# Altium project Elkapod_power_supply.PrjPcb (part 3 of 6)

## Sheet Servos_DC_converter.SchDoc
size A3; SheetNumber: 4; SheetTotal: 10
Used 4 times, as channels U_Servos_DC_converter, U_Servos_DC_converter, U_Servos_DC_converter, U_Servos_DC_converter. Parts and nets are listed once, with the designators drawn on the sheet.
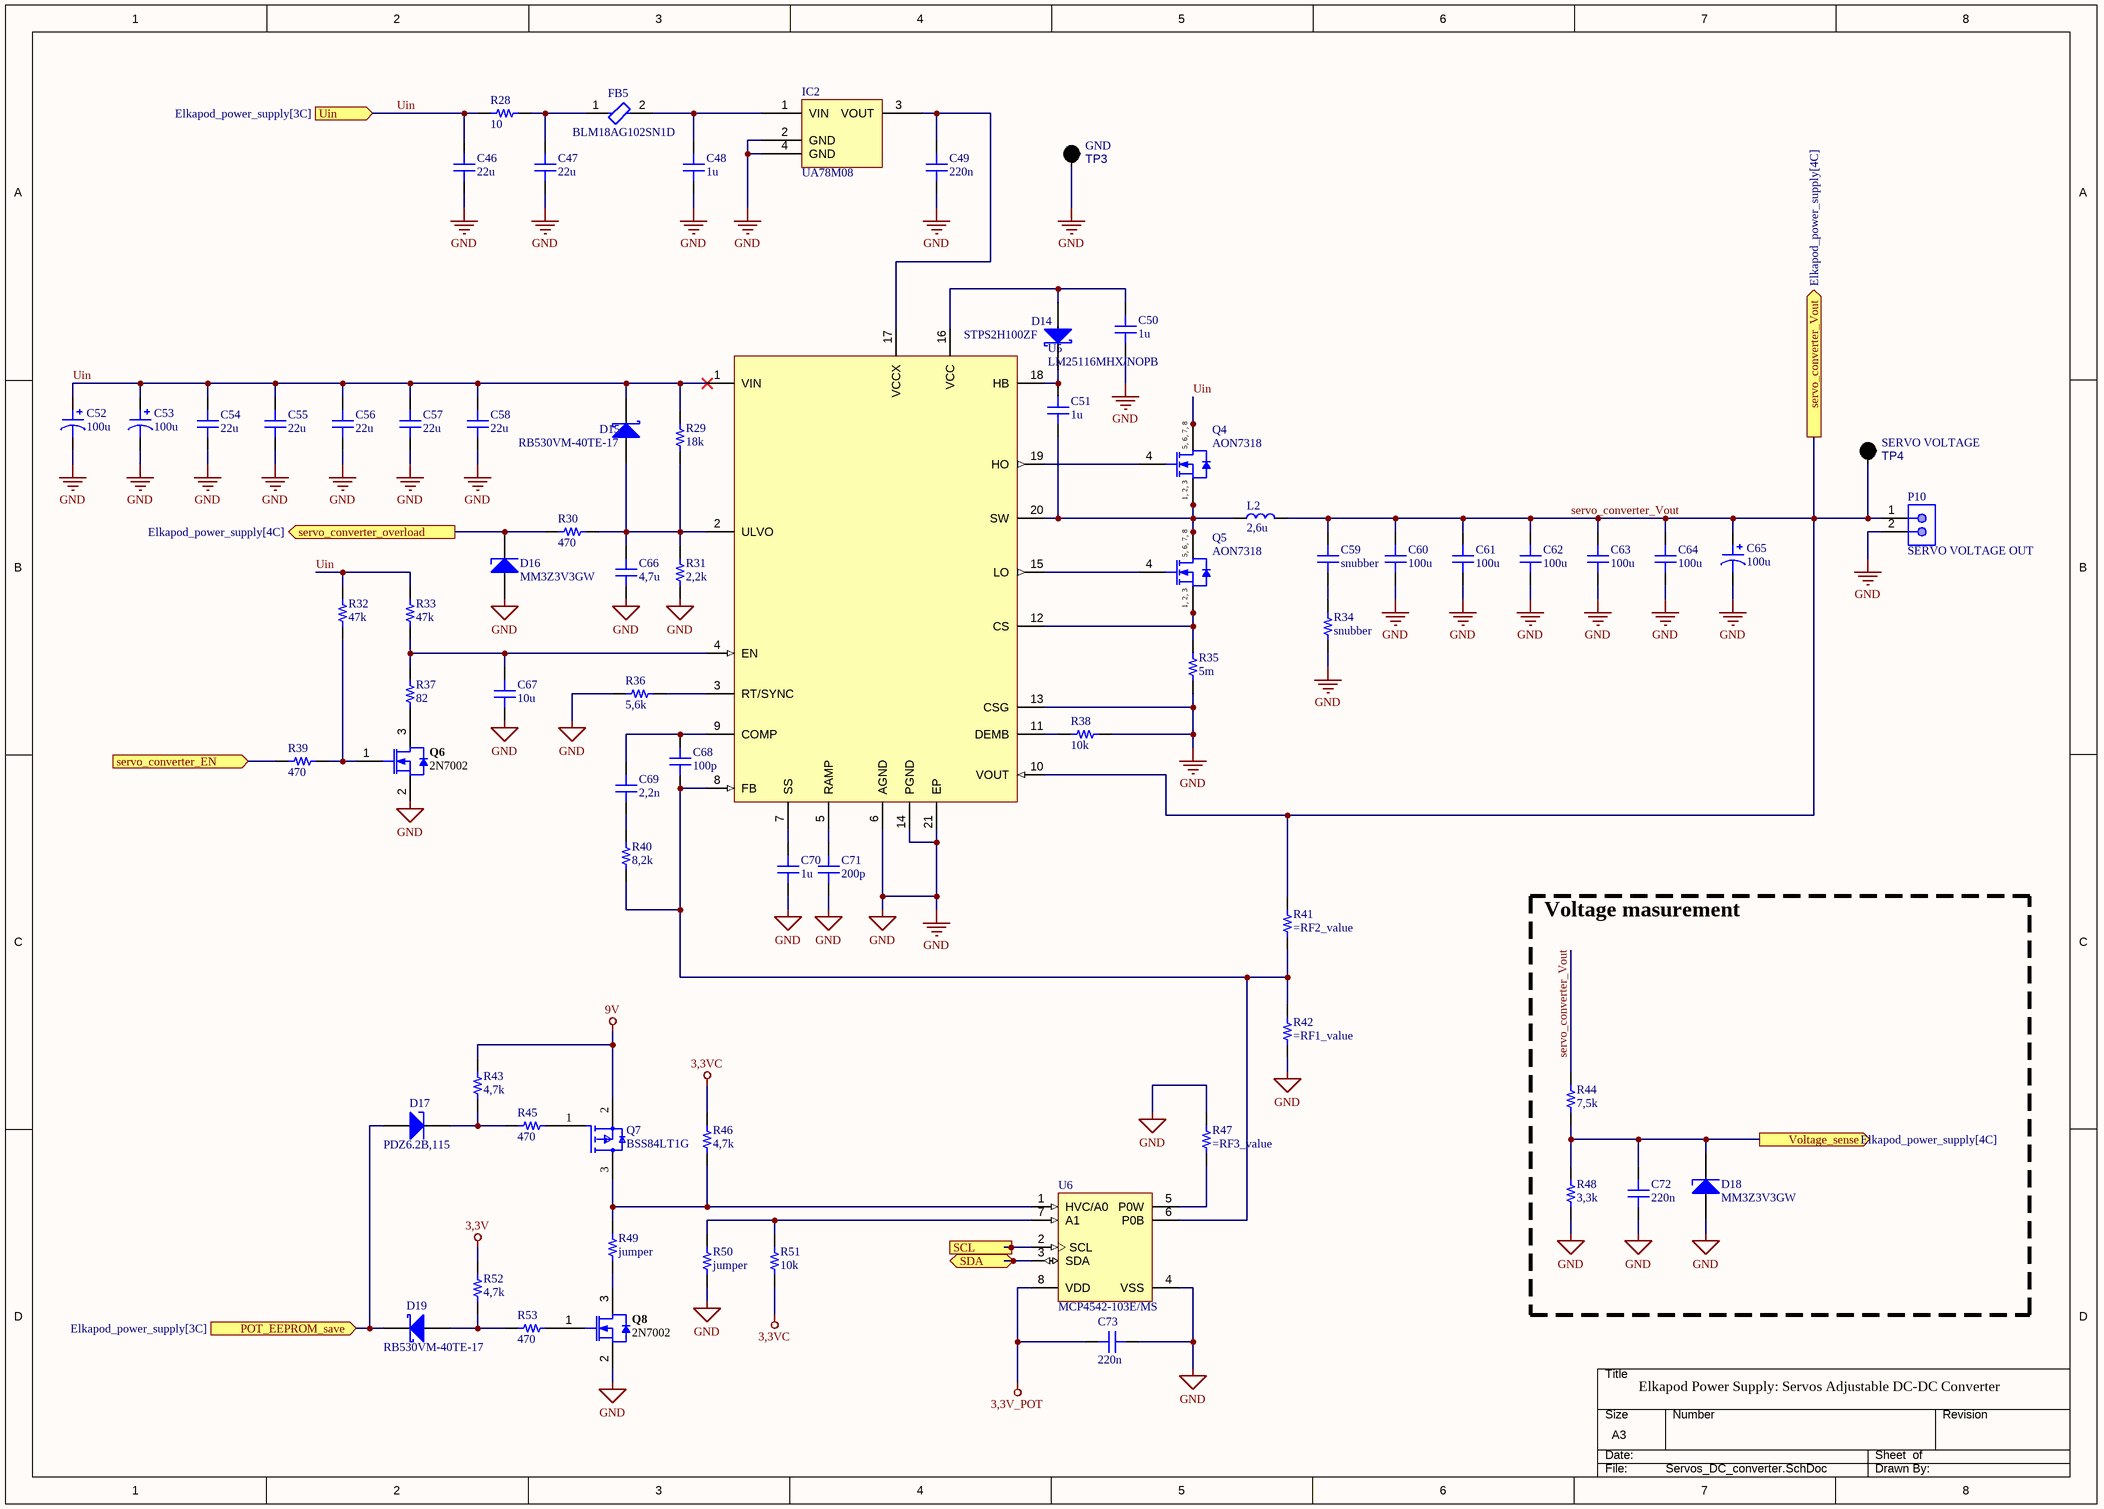
[diagram p6: Servos_DC_converter.SchDoc]

### Parts
C46  22u  [CAP 0805_2012]
C47  22u  [CAP 0805_2012]
C48  1u  [CAP 0603_1608]
C49  220n  [CAP 0603_1608]
C50  1u  [CAP 0603_1608]
C51  1u  [CAP 0603_1608]
C52  100u  [CAP ALSMD 8.3MM H10.5MM]
C53  100u  [CAP ALSMD 8.3MM H10.5MM]
C54  22u  [CAP 0805_2012]
C55  22u  [CAP 0805_2012]
C56  22u  [CAP 0805_2012]
C57  22u  [CAP 0805_2012]
C58  22u  [CAP 0805_2012]
C59  snubber  [CAP 0603_1608]
C60  100u  [CAP 1210_3225 - 1MM]
C61  100u  [CAP 1210_3225 - 1MM]
C62  100u  [CAP 1210_3225 - 1MM]
C63  100u  [CAP 1210_3225 - 1MM]
C64  100u  [CAP 1210_3225 - 1MM]
C65  100u  [CAP ALSMD 8.3MM H10.5MM]
C66  4,7u  [CAP 0603_1608]
C67  10u  [CAP 0603_1608]
C68  100p  [CAP 0603_1608]
C69  2,2n  [CAP 0603_1608]
C70  1u  [CAP 0603_1608]
C71  200p  [CAP 0603_1608]
C72  220n  [CAP 0603_1608]
C73  220n  [CAP 0603_1608]
D14  STPS2H100ZF  [DIOD-SOD-123-2_V]
D15  RB530VM-40TE-17  [SOD-323]
D16  MM3Z3V3GW  [SOD323]
D17  PDZ6.2B,115  [SOD323]
D18  MM3Z3V3GW  [SOD323]
D19  RB530VM-40TE-17  [SOD-323]
FB5  BLM18AG102SN1D  [FP-BLM18-0_15-t0_8-MFG]
IC2  UA78M08  [TI SOT-223 DCY]
L2  2,6u  [18,3x18,2_INDUCTOR]
P10  SERVO VOLTAGE OUT  [MOLX-22-23-2021_V]
Q4  AON7318  [INF-PG-TSDSON-8-1_V]
Q5  AON7318  [INF-PG-TSDSON-8-1_V]
Q6  2N7002  [INF-PG-SOT23_M]
Q7  BSS84LT1G  [FP-318-08-IPC_A]
Q8  2N7002  [INF-PG-SOT23_M]
R28  10  [RES 1206_3216]
R29  18k  [RES 0603_1608]
R30  470  [RES 0603_1608]
R31  2,2k  [RES 0603_1608]
R32  47k  [RES 0603_1608]
R33  47k  [RES 0603_1608]
R34  snubber  [RES 1206_3216]
R35  5m  [STACKPOLE CSM2512]
R36  5,6k  [RES 0603_1608]
R37  82  [RES 0603_1608]
R38  10k  [RES 0603_1608]
R39  470  [RES 0603_1608]
R40  8,2k  [RES 0603_1608]
R41  (no value)  [RES 0603_1608]
R42  (no value)  [RES 0603_1608]
R43  4,7k  [RES 0603_1608]
R44  7,5k  [RES 0603_1608]
R45  470  [RES 0603_1608]
R46  4,7k  [RES 0603_1608]
R47  (no value)  [RES 0603_1608]
R48  3,3k  [RES 0603_1608]
R49  jumper  [RES 0603_1608]
R50  jumper  [RES 0603_1608]
R51  10k  [RES 0603_1608]
R52  4,7k  [RES 0603_1608]
R53  470  [RES 0603_1608]
TP3  GND  [Keystone_5006_BLACK]
TP4  SERVO VOLTAGE  [Keystone_5006_BLACK]
U5  LM25116MHX/NOPB  [PWP0020A_L]
U6  MCP4542-103E/MS  [MSOP-MS8_N]

### Blocks framed on the sheet
Voltage masurement: C72 D18 R44 R48

### Ports
POT_EEPROM_save (in, see Elkapod_power_supply[3C]), SCL (in, see Elkapod_power_supply[3C], Controllable_voltage_outputs[2A], Electronics_power_supply_DC_converter[7C], Logic_controller[1D], Servos_controller[1C]), SDA (bidir, see Elkapod_power_supply[3C], Controllable_voltage_outputs[2B], Electronics_power_supply_DC_converter[7C], Logic_controller[1D], Servos_controller[1C]), servo_converter_EN (in, see Elkapod_power_supply[4C]), servo_converter_overload (out, see Elkapod_power_supply[4C]), servo_converter_Vout (out, see Elkapod_power_supply[4C]), Uin (in, see Elkapod_power_supply[3C]), Voltage_sense (out, see Elkapod_power_supply[4C])

### Nets
3,3V: R52.1
3,3V_POT: C73.2 U6.8(VDD)
3,3VC: R46.1 R51.2
9V: Q7.2(S) R43.1
GND: C46.1 C47.1 C48.1 C49.1 C50.2 C52.2 C53.2 C54.1 C55.1 C56.1 C57.1 C58.1 C60.1 C61.1 C62.1 C63.1 C64.1 C65.2 C66.1 C67.1 C70.1 C71.1 C72.1 C73.1 D16.1(A) D18.1(A) IC2.2(GND) IC2.4(GND) P10.2 Q6.2(SOURCE) Q8.2(SOURCE) R31.1 R34.1 R35.1 R36.2 R38.1 R42.2 R47.1 R48.2 R50.2 TP3.0 U5.6(AGND) U5.13(CSG) U5.14(PGND) U5.21(EP) U6.4(VSS)
POT_EEPROM_save: D17.1(A) D19.1(K) ; port POT_EEPROM_save
SCL: U6.2(SCL) ; port SCL
SDA: U6.3(SDA) ; port SDA
servo_converter_EN: R39.1 ; port servo_converter_EN
servo_converter_overload: D16.2(K) R30.2 ; port servo_converter_overload
servo_converter_Vout: C59.2 C60.2 C61.2 C62.2 C63.2 C64.2 C65.1 L2.2 P10.1 R41.1 R44.1 TP4.0 U5.10(VOUT) ; port servo_converter_Vout
Uin: C46.2 C52.1 C53.1 C54.2 C55.2 C56.2 C57.2 C58.2 D15.1(K) Q4.5(DRAIN) Q4.6(DRAIN) Q4.7(DRAIN) Q4.8(DRAIN) R28.1 R29.1 R32.1 R33.1 U5.1(VIN) ; port Uin
Voltage_sense: C72.2 D18.2(K) R44.2 R48.1 ; port Voltage_sense
NetC47_2: C47.2 FB5.1 R28.2
NetC48_2: C48.2 FB5.2 IC2.1(VIN)
NetC49_2: C49.2 IC2.3(VOUT) U5.17(VCCX)
NetC50_1: C50.1 D14.1(A) U5.16(VCC)
NetC51_1: C51.1 L2.1 Q4.1(SOURCE) Q4.2(SOURCE) Q4.3(SOURCE) Q5.5(DRAIN) Q5.6(DRAIN) Q5.7(DRAIN) Q5.8(DRAIN) U5.20(SW)
NetC51_2: C51.2 D14.2(K) U5.18(HB)
NetC59_1: C59.1 R34.2
NetC66_2: C66.2 D15.2(A) R29.2 R30.1 R31.2 U5.2(ULVO)
NetC67_2: C67.2 R33.2 R37.1 U5.4(EN)
NetC68_1: C68.1 C69.1 U5.9(COMP)
NetC68_2: C68.2 R40.2 R41.2 R42.1 U5.8(FB) U6.6(P0B)
NetC69_2: C69.2 R40.1
NetC70_2: C70.2 U5.7(SS)
NetC71_2: C71.2 U5.5(RAMP)
NetD17_2: D17.2(K) R43.2 R45.2
NetD19_2: D19.2(A) R52.2 R53.2
NetQ4_4: Q4.4(GATE) U5.19(HO)
NetQ5_1: Q5.1(SOURCE) Q5.2(SOURCE) Q5.3(SOURCE) R35.2 U5.12(CS)
NetQ5_4: Q5.4(GATE) U5.15(LO)
NetQ6_1: Q6.1(GATE) R32.2 R39.2
NetQ6_3: Q6.3(DRAIN) R37.2
NetQ7_1: Q7.1(G) R45.1
NetQ7_3: Q7.3(D) R46.2 R49.1 U6.1(HVC/A0)
NetQ8_1: Q8.1(GATE) R53.1
NetQ8_3: Q8.3(DRAIN) R49.2
NetR36_1: R36.1 U5.3(RT/SYNC)
NetR38_2: R38.2 U5.11(DEMB)
NetR47_2: R47.2 U6.5(P0W)
NetR50_1: R50.1 R51.1 U6.7(A1)

### Channels
U_Servos_DC_converter: designators C46=C46_1 C47=C47_1 C48=C48_1 C49=C49_1 C50=C50_1 C51=C51_1 C52=C52_1 C53=C53_1 C54=C54_1 C55=C55_1 C56=C56_1 C57=C57_1 C58=C58_1 C59=C59_1 C60=C60_1 C61=C61_1 C62=C62_1 C63=C63_1 C64=C64_1 C65=C65_1 C66=C66_1 C67=C67_1 C68=C68_1 C69=C69_1 C70=C70_1 C71=C71_1 C72=C72_1#2 C73=C73_1#2 D14=D14_1 D15=D15_1 D16=D16_1 D17=D17_1 D18=D18_1 D19=D19_1 FB5=FB5_1 IC2=IC2_1 L2=L2_1 P10=P10_1 Q4=Q4_1 Q5=Q5_1 Q6=Q6_1 Q7=Q7_1#2 Q8=Q8_1#2 R28=R28_1 R29=R29_1 R30=R30_1 R31=R31_1 R32=R32_1 R33=R33_1 R34=R34_1 R35=R35_1 R36=R36_1 R37=R37_1 R38=R38_1 R39=R39_1 R40=R40_1 R41=R41_1 R42=R42_1 R43=R43_1 R44=R44_1 R45=R45_1 R46=R46_1#2 R47=R47_1#2 R48=R48_1#2 R49=R49_1#2 R50=R50_1#2 R51=R51_1 R52=R52_1 R53=R53_1 TP3=TP3_1 TP4=TP4_1 U5=U5_1 U6=U6_1; ports POT_EEPROM_save=POT_HVC SCL=SCL SDA=SDA servo_converter_EN=NetR39_1_1 servo_converter_overload=CONV1_OC servo_converter_Vout=servo_converter_Vout Uin=Uin Voltage_sense=NetC72_1#2_2
U_Servos_DC_converter: designators C46=C46_2 C47=C47_2 C48=C48_2 C49=C49_2 C50=C50_2 C51=C51_2 C52=C52_2 C53=C53_2 C54=C54_2 C55=C55_2 C56=C56_2 C57=C57_2 C58=C58_2 C59=C59_2 C60=C60_2 C61=C61_2 C62=C62_2 C63=C63_2 C64=C64_2 C65=C65_2 C66=C66_2 C67=C67_2 C68=C68_2 C69=C69_2 C70=C70_2 C71=C71_2 C72=C72_2#2 C73=C73_2#2 D14=D14_2 D15=D15_2 D16=D16_2 D17=D17_2 D18=D18_2 D19=D19_2 FB5=FB5_2 IC2=IC2_2 L2=L2_2 P10=P10_2 Q4=Q4_2 Q5=Q5_2 Q6=Q6_2 Q7=Q7_2#2 Q8=Q8_2#2 R28=R28_2 R29=R29_2 R30=R30_2 R31=R31_2 R32=R32_2 R33=R33_2 R34=R34_2 R35=R35_2 R36=R36_2 R37=R37_2 R38=R38_2 R39=R39_2 R40=R40_2 R41=R41_2 R42=R42_2 R43=R43_2 R44=R44_2 R45=R45_2 R46=R46_2#2 R47=R47_2#2 R48=R48_2#2 R49=R49_2#2 R50=R50_2#2 R51=R51_2 R52=R52_2 R53=R53_2 TP3=TP3_2 TP4=TP4_2 U5=U5_2 U6=U6_2; ports POT_EEPROM_save=POT_HVC SCL=SCL SDA=SDA servo_converter_EN=NetR39_2_1 servo_converter_overload=CONV2_OC servo_converter_Vout=servo_converter_Vout Uin=Uin Voltage_sense=NetC72_2#2_2
U_Servos_DC_converter: designators C46=C46_3 C47=C47_3 C48=C48_3 C49=C49_3 C50=C50_3 C51=C51_3 C52=C52_3 C53=C53_3 C54=C54_3 C55=C55_3 C56=C56_3 C57=C57_3 C58=C58_3 C59=C59_3 C60=C60_3 C61=C61_3 C62=C62_3 C63=C63_3 C64=C64_3 C65=C65_3 C66=C66_3 C67=C67_3 C68=C68_3 C69=C69_3 C70=C70_3 C71=C71_3 C72=C72_3#2 C73=C73_3#2 D14=D14_3 D15=D15_3 D16=D16_3 D17=D17_3 D18=D18_3 D19=D19_3 FB5=FB5_3 IC2=IC2_3 L2=L2_3 P10=P10_3 Q4=Q4_3 Q5=Q5_3 Q6=Q6_3 Q7=Q7_3#2 Q8=Q8_3#2 R28=R28_3 R29=R29_3 R30=R30_3 R31=R31_3 R32=R32_3 R33=R33_3 R34=R34_3 R35=R35_3 R36=R36_3 R37=R37_3 R38=R38_3 R39=R39_3 R40=R40_3 R41=R41_3 R42=R42_3 R43=R43_3 R44=R44_3 R45=R45_3 R46=R46_3#2 R47=R47_3#2 R48=R48_3#2 R49=R49_3#2 R50=R50_3#2 R51=R51_3 R52=R52_3 R53=R53_3 TP3=TP3_3 TP4=TP4_3 U5=U5_3 U6=U6_3; ports POT_EEPROM_save=POT_HVC SCL=SCL SDA=SDA servo_converter_EN=NetR39_3_1 servo_converter_overload=CONV3_OC servo_converter_Vout=servo_converter_Vout Uin=Uin Voltage_sense=NetC72_3#2_2
U_Servos_DC_converter: designators C46=C46_4 C47=C47_4 C48=C48_4 C49=C49_4 C50=C50_4 C51=C51_4 C52=C52_4 C53=C53_4 C54=C54_4 C55=C55_4 C56=C56_4 C57=C57_4 C58=C58_4 C59=C59_4 C60=C60_4 C61=C61_4 C62=C62_4 C63=C63_4 C64=C64_4 C65=C65_4 C66=C66_4 C67=C67_4 C68=C68_4 C69=C69_4 C70=C70_4 C71=C71_4 C72=C72_4#2 C73=C73_4#2 D14=D14_4 D15=D15_4 D16=D16_4 D17=D17_4 D18=D18_4 D19=D19_4 FB5=FB5_4 IC2=IC2_4 L2=L2_4 P10=P10_4 Q4=Q4_4 Q5=Q5_4 Q6=Q6_4 Q7=Q7_4#2 Q8=Q8_4#2 R28=R28_4 R29=R29_4 R30=R30_4 R31=R31_4 R32=R32_4 R33=R33_4 R34=R34_4 R35=R35_4 R36=R36_4 R37=R37_4 R38=R38_4 R39=R39_4 R40=R40_4 R41=R41_4 R42=R42_4 R43=R43_4 R44=R44_4 R45=R45_4 R46=R46_4#2 R47=R47_4#2 R48=R48_4#2 R49=R49_4#2 R50=R50_4#2 R51=R51_4 R52=R52_4 R53=R53_4 TP3=TP3_4 TP4=TP4_4 U5=U5_4 U6=U6_4; ports POT_EEPROM_save=POT_HVC SCL=SCL SDA=SDA servo_converter_EN=MANIP_CONV_EN servo_converter_overload=CONV4_OC servo_converter_Vout=servo_converter_Vout Uin=Uin Voltage_sense=U_CONV4_SENSE

### Notes on the sheet
- Elkapod Power Supply: Servos Adjustable DC-DC Converter
- DWG. NO.
- REV.
- SHT.
- THIS DOCUMENT AND THE DATA DISCLOSED HEREIN OR HEREWITH IS THE PROPERTY OF ALTIUM LIMITED AND MAY BE FREELY DISTRIBUTED IN WHOLE. NO RIGHTS ARE RESERVED OR EXPRESS OR IMPLIED WARANTEE GIVEN.
- REVISION
- DESCRIPTION
- DATE
- APPROVED
- ENG:
- APPROVALS
- PROJECT
- DSN:
- CHK:
- REFERENCE DOCUMENTS
- PROJECT REVISION:
- TITLE
- DOCUMENT REVISION:
- DESIGN ITEM:
- BOM:
- FAB DWG:
- PCB DWG:
- ASSY DWG:
- SCALE:
- SIZE
- B
- CAGE CODE
- FILE NAME
- DWG NO.
- SHEET
- OF
- REV
- (in symbol BSZ050N03MS G) 5, 6, 7, 8; 1, 2, 3
- (in symbol AON7318) 5, 6, 7, 8; 1, 2, 3

### Library data of the parts
C46 C47 C54-C58 = VJ0805Y684KXQTW1BC: CAP CER 22UF 25V X7R 0805; manufacturer: Vishay Vitramon; Tolerance: ±10%; Voltage - Rated: 10V; Part Number: VJ0805Y684KXQTW1BC; Value: 22u; Applications: General Purpose; Capacitance: 22u; componentlink1description: Datasheet; componentlink1url: https://www.vishay.com/docs/28548/vjw1bcbascomseries.pdf; componentlink2description: DigiKey Link; componentlink2url: https://www.digikey.com/en/products/detail/vishay-vitramon/VJ0805Y684KXQTW1BC/8313569; Device Package: 0805 (2012 Metric); lastupdated: 09.02.2024 20:13:13; Lifecycle Status: Active; Minimum Order: 1; Mounting Type: Surface Mount, MLCC; Operating Temperature: -55°C ~ 125°C; Package / Case: 0805 (2012 Metric); packaging: TapeAndReel; partid: 57262; price: 0.05; series: VJ W1BC; Size / Dimension: 0.079" L x 0.049" W (2.00mm x 1.25mm); Temperature Coefficient: X7R; Thickness (Max): 0.053" (1.35mm)
C48 C50 C51 = C0603C272F3GAC7867: CAP CER 1uF 25V X5R 0603; manufacturer: KEMET; Temperature Coefficient: C0G, NP0; Tolerance: ±1%; Part Number: C0603C272F3GAC7867; Value: 1u; Applications: General Purpose; Capacitance: 1u; componentlink1description: Datasheet; componentlink1url: https://api.kemet.com/component-edge/download/datasheet/C0603C272F3GACTU.pdf; componentlink2description: DigiKey Link; componentlink2url: https://www.digikey.com/en/products/detail/kemet/C0603C272F3GAC7867/2200413; Device Package: 0603 (1608 Metric); Features: Low ESL; lastupdated: 09.02.2024 20:10:30; Lifecycle Status: Active; Minimum Order: 1; Mounting Type: Surface Mount, MLCC; Operating Temperature: -55°C ~ 125°C; Package / Case: 0603 (1608 Metric); packaging: TapeAndReel; partid: 2138; Part Status: Active; price: 0.40; series: SMD Comm C0G; Size / Dimension: 0.063" L x 0.031" W (1.60mm x 0.80mm); Thickness (Max): 0.034" (0.87mm); Voltage - Rated: 25V
C49 C72 C73 = C0603C272F3GAC7867: CAP CER 220nF 25V X5R 0603; manufacturer: KEMET; Temperature Coefficient: C0G, NP0; Tolerance: ±1%; Part Number: C0603C272F3GAC7867; Value: 220n; Applications: General Purpose; Capacitance: 220n; componentlink1description: Datasheet; componentlink1url: https://api.kemet.com/component-edge/download/datasheet/C0603C272F3GACTU.pdf; componentlink2description: DigiKey Link; componentlink2url: https://www.digikey.com/en/products/detail/kemet/C0603C272F3GAC7867/2200413; Device Package: 0603 (1608 Metric); Features: Low ESL; lastupdated: 09.02.2024 20:10:30; Lifecycle Status: Active; Minimum Order: 1; Mounting Type: Surface Mount, MLCC; Operating Temperature: -55°C ~ 125°C; Package / Case: 0603 (1608 Metric); packaging: TapeAndReel; partid: 2138; Part Status: Active; price: 0.40; series: SMD Comm C0G; Size / Dimension: 0.063" L x 0.031" W (1.60mm x 0.80mm); Thickness (Max): 0.034" (0.87mm); Voltage - Rated: 25V
C52 C53 C65 = EEE-TC1C101P: UCD1V101MNL1GS; CAP ALUM 100UF 20% 16V SMD; value: 100u
C59 = C0603C272F3GAC7867: CAP CER 50V X5R 0603; manufacturer: KEMET; Temperature Coefficient: C0G, NP0; Tolerance: ±1%; Voltage - Rated: 25V; Part Number: C0603C272F3GAC7867; Value: snubber; Applications: General Purpose; Capacitance: snubber; componentlink1description: Datasheet; componentlink1url: https://api.kemet.com/component-edge/download/datasheet/C0603C272F3GACTU.pdf; componentlink2description: DigiKey Link; componentlink2url: https://www.digikey.com/en/products/detail/kemet/C0603C272F3GAC7867/2200413; Device Package: 0603 (1608 Metric); Features: Low ESL; lastupdated: 09.02.2024 20:10:30; Lifecycle Status: Active; Minimum Order: 1; Mounting Type: Surface Mount, MLCC; Operating Temperature: -55°C ~ 125°C; Package / Case: 0603 (1608 Metric); packaging: TapeAndReel; partid: 2138; Part Status: Active; price: 0.40; series: SMD Comm C0G; Size / Dimension: 0.063" L x 0.031" W (1.60mm x 0.80mm); Thickness (Max): 0.034" (0.87mm)
C60-C64 = CAN13X104KARAC7800: CAP CER 1210 100UF 10V X7R; manufacturer: KEMET; Tolerance: ±10%; Voltage - Rated: 250VAC; Part Number: CAN13X104KARAC7800; Value: 100u; Applications: Boardflex Sensitive; Capacitance: 100u; componentlink1description: Datasheet; componentlink1url: //media.digikey.com/pdf/Data%20Sheets/Kemet%20PDFs/CAN13X104KARACTU_Spec.pdf; componentlink2description: DigiKey Link; componentlink2url: https://www.digikey.com/en/products/detail/kemet/CAN13X104KARAC7800/9962480; Device Package: 1210 (3225 Metric); Features: Low ESL, Soft Termination; lastupdated: 04.06.2024 19:21:07; Lifecycle Status: Active; Minimum Order: 1; Mounting Type: Surface Mount, MLCC; Operating Temperature: -55°C ~ 125°C; Package / Case: 1210 (3225 Metric); packaging: TapeAndReel; partid: 23615; Part Status: Active; price: 0.39; series: CAN SMD Indust X7R; Size / Dimension: 0.130" L x 0.102" W (3.30mm x 2.60mm); Temperature Coefficient: X7R; Thickness (Max): 0.110" (2.80mm)
C66 = C0603C272F3GAC7867: CAP CER 4,7uF 25V X5R 0603; manufacturer: KEMET; Temperature Coefficient: C0G, NP0; Tolerance: ±1%; Part Number: C0603C272F3GAC7867; Value: 4,7u; Applications: General Purpose; Capacitance: 4,7u; componentlink1description: Datasheet; componentlink1url: https://api.kemet.com/component-edge/download/datasheet/C0603C272F3GACTU.pdf; componentlink2description: DigiKey Link; componentlink2url: https://www.digikey.com/en/products/detail/kemet/C0603C272F3GAC7867/2200413; Device Package: 0603 (1608 Metric); Features: Low ESL; lastupdated: 09.02.2024 20:10:30; Lifecycle Status: Active; Minimum Order: 1; Mounting Type: Surface Mount, MLCC; Operating Temperature: -55°C ~ 125°C; Package / Case: 0603 (1608 Metric); packaging: TapeAndReel; partid: 2138; Part Status: Active; price: 0.40; series: SMD Comm C0G; Size / Dimension: 0.063" L x 0.031" W (1.60mm x 0.80mm); Thickness (Max): 0.034" (0.87mm); Voltage - Rated: 25V
C67 = C0603C272F3GAC7867: CAP CER 10uF 35V X5R 0603; manufacturer: KEMET; Temperature Coefficient: C0G, NP0; Tolerance: ±1%; Voltage - Rated: 25V; Part Number: C0603C272F3GAC7867; Value: 10u; Applications: General Purpose; Capacitance: 10u; componentlink1description: Datasheet; componentlink1url: https://api.kemet.com/component-edge/download/datasheet/C0603C272F3GACTU.pdf; componentlink2description: DigiKey Link; componentlink2url: https://www.digikey.com/en/products/detail/kemet/C0603C272F3GAC7867/2200413; Device Package: 0603 (1608 Metric); Features: Low ESL; lastupdated: 09.02.2024 20:10:30; Lifecycle Status: Active; Minimum Order: 1; Mounting Type: Surface Mount, MLCC; Operating Temperature: -55°C ~ 125°C; Package / Case: 0603 (1608 Metric); packaging: TapeAndReel; partid: 2138; Part Status: Active; price: 0.40; series: SMD Comm C0G; Size / Dimension: 0.063" L x 0.031" W (1.60mm x 0.80mm); Thickness (Max): 0.034" (0.87mm)
C68 = C0603C272F3GAC7867: CAP CER 100pF 50V G0C 0603; manufacturer: KEMET; Temperature Coefficient: C0G, NP0; Tolerance: ±1%; Voltage - Rated: 25V; Part Number: C0603C272F3GAC7867; Value: 100p; Applications: General Purpose; Capacitance: 100p; componentlink1description: Datasheet; componentlink1url: https://api.kemet.com/component-edge/download/datasheet/C0603C272F3GACTU.pdf; componentlink2description: DigiKey Link; componentlink2url: https://www.digikey.com/en/products/detail/kemet/C0603C272F3GAC7867/2200413; Device Package: 0603 (1608 Metric); Features: Low ESL; lastupdated: 09.02.2024 20:10:30; Lifecycle Status: Active; Minimum Order: 1; Mounting Type: Surface Mount, MLCC; Operating Temperature: -55°C ~ 125°C; Package / Case: 0603 (1608 Metric); packaging: TapeAndReel; partid: 2138; Part Status: Active; price: 0.40; series: SMD Comm C0G; Size / Dimension: 0.063" L x 0.031" W (1.60mm x 0.80mm); Thickness (Max): 0.034" (0.87mm)
C69 = C0603C272F3GAC7867: CAP CER 2,2nF 50V G0C 0603; manufacturer: KEMET; Temperature Coefficient: C0G, NP0; Tolerance: ±1%; Voltage - Rated: 25V; Part Number: C0603C272F3GAC7867; Value: 2,2n; Applications: General Purpose; Capacitance: 2,2n; componentlink1description: Datasheet; componentlink1url: https://api.kemet.com/component-edge/download/datasheet/C0603C272F3GACTU.pdf; componentlink2description: DigiKey Link; componentlink2url: https://www.digikey.com/en/products/detail/kemet/C0603C272F3GAC7867/2200413; Device Package: 0603 (1608 Metric); Features: Low ESL; lastupdated: 09.02.2024 20:10:30; Lifecycle Status: Active; Minimum Order: 1; Mounting Type: Surface Mount, MLCC; Operating Temperature: -55°C ~ 125°C; Package / Case: 0603 (1608 Metric); packaging: TapeAndReel; partid: 2138; Part Status: Active; price: 0.40; series: SMD Comm C0G; Size / Dimension: 0.063" L x 0.031" W (1.60mm x 0.80mm); Thickness (Max): 0.034" (0.87mm)
C70 = C0603C272F3GAC7867: CAP CER 1uF 16V X5R 0603; manufacturer: KEMET; Temperature Coefficient: C0G, NP0; Tolerance: ±1%; Voltage - Rated: 25V; Part Number: C0603C272F3GAC7867; Value: 1u; Applications: General Purpose; Capacitance: 1u; componentlink1description: Datasheet; componentlink1url: https://api.kemet.com/component-edge/download/datasheet/C0603C272F3GACTU.pdf; componentlink2description: DigiKey Link; componentlink2url: https://www.digikey.com/en/products/detail/kemet/C0603C272F3GAC7867/2200413; Device Package: 0603 (1608 Metric); Features: Low ESL; lastupdated: 09.02.2024 20:10:30; Lifecycle Status: Active; Minimum Order: 1; Mounting Type: Surface Mount, MLCC; Operating Temperature: -55°C ~ 125°C; Package / Case: 0603 (1608 Metric); packaging: TapeAndReel; partid: 2138; Part Status: Active; price: 0.40; series: SMD Comm C0G; Size / Dimension: 0.063" L x 0.031" W (1.60mm x 0.80mm); Thickness (Max): 0.034" (0.87mm)
C71 = C0603C272F3GAC7867: CAP CER 200pF 50V G0C 0603; manufacturer: KEMET; Temperature Coefficient: C0G, NP0; Tolerance: ±1%; Voltage - Rated: 25V; Part Number: C0603C272F3GAC7867; Value: 200p; Applications: General Purpose; Capacitance: 200p; componentlink1description: Datasheet; componentlink1url: https://api.kemet.com/component-edge/download/datasheet/C0603C272F3GACTU.pdf; componentlink2description: DigiKey Link; componentlink2url: https://www.digikey.com/en/products/detail/kemet/C0603C272F3GAC7867/2200413; Device Package: 0603 (1608 Metric); Features: Low ESL; lastupdated: 09.02.2024 20:10:30; Lifecycle Status: Active; Minimum Order: 1; Mounting Type: Surface Mount, MLCC; Operating Temperature: -55°C ~ 125°C; Package / Case: 0603 (1608 Metric); packaging: TapeAndReel; partid: 2138; Part Status: Active; price: 0.40; series: SMD Comm C0G; Size / Dimension: 0.063" L x 0.031" W (1.60mm x 0.80mm); Thickness (Max): 0.034" (0.87mm)
D14 = CMP-0303-00004-1: Schottky diode; 2A; 100V
D15 D19 = BAS140W: Schottky diode; 0,1A; 40V; Published: 21-Mar-2003; LatestRevisionDate: 19-Mar-2004; LatestRevisionNote: Silkscreen size reduced.; DatasheetDocument: Oct-1999; PackageDocument: Sep-2000; PackageReference: SOD-323; Publisher: Altium Limited; ComponentLink1Description: Manufacturer Link; ComponentLink1URL: http://www.infineon.com/; ComponentLink2Description: Datasheet; ComponentLink2URL: http://www.infineon.com/upload/Document/cmc_upload/documents/009/386/bas70_bas170series_1.pdf
D16 D18 = Zener_Diode_SOD323: 3,3V, 0,3W Zener diode; SOD323
D17 = Zener_Diode_SOD323: 6,2V, 0,4W Zener diode
FB5 = CMP-0686-00457-3: Chip Ferrite Bead, 0603, 1000Ω @ 100MHz, 0.5Ω, 25%, 450mA; Number of Circuits: 1; Max DC Current: 400mA; Shielding: Unshielded; DC Resistance (DCR): 500mR; Material: Steel; DC Resistance-Max: 700mR; Impedance: 1kR; Case Code (Imperial): 0603; Max Current Rating: 400mA; Frequency: 100MHz; Min Operating Temperature: -55°C; Case/Package: 0603; Depth: 0.8mm; Lead Free: Lead Free; Core Material: Ferrite; Current Rating: 400mA; Resistance: 500mR; Case Code (Metric): 1608; DC Current: 400mA; Package Quantity: 1; Packaging: Tape and Reel; Width: 0.8mm; Military Standard: Not; Height: 0.8mm; Series: BLM18A; Max Operating Temperature: 125°C; Tolerance: 25%; Termination: SMD/SMT; Test Frequency: 100MHz; Number of Lines: 1; Number of Pins: 2; REACH SVHC: No SVHC; Length: 1.6mm; Radiation Hardening: No
IC2 = LM340MP-5.0/NOPB: IC REG LINEAR 8V 0,5A SOT223; Manufacturer: Texas Instruments; Current - Output: 1.5A; Number of Regulators: 1; Output Configuration: Positive; Output Type: Fixed; Part Number: UA78M08; ComponentLink1Description: Datasheet; ComponentLink1URL: http://www.ti.com/general/docs/suppproductinfo.tsp?distId=10&gotoUrl=http%3A%2F%2Fwww.ti.com%2Flit%2Fgpn%2Flm340; ComponentLink2Description: DigiKey Link; ComponentLink2URL: //digikey.com/product-detail/en/texas-instruments/LM340MP-5.0-NOPB/LM340MP-5.0-NOPBTR-ND/270717; Lifecycle Status: 0; Operating Temperature: 0°C ~ 125°C; Package / Case: TO-261-4, TO-261AA; Packaging: TapeAndReel; Voltage - Output (Min/Fixed): 8V
L2 = 18,3x18,2_INDUCTOR: Power inductor, 2,6uH, Imax = 25,5A, Isat = 50A
P10 = CMP-1704-00001-3: Male Header, Pitch 2.54 mm, 1 x 2 Position, Height 10.67 mm, Tail Length 3.56 mm, 0 to 75 degC, RoHS, Bulk; Package Quantity: 3000; Height: 10.67 mm; RoHSCompliant: True; ComponentLink2URL: https://datasheet.ciiva.com/19454/232266-19454304.pdf; PartNumber: 22-23-2021; Packaging: Bulk; ComponentLink2Description: Datasheet; Min Operating Temperature: 0 degC; ComponentLink1Description: Manufacturer URL; Length: 5.08 mm; Mounting Technology: Through Hole; Max Operating Temperature: 75 degC; REACH SVHC: Unknown; PackageDescription: Male Header, Pitch 2.54 mm, 1 x 2 Position, Height 10.67 mm, Tail Length 3.56 mm; ComponentLink1URL: http://www.molex.com/; Mount: Through Hole; Radiation Hardening: No; Width: 6.35 mm; Pins: 2
Q4 Q5 = BSZ050N03MS G: N-Channel Power-MOSFET, 30 V VDS, 50 A ID, PG-TSDSON-8-1; Manufacturer: Infineon; ID (max): 50 A; IDpuls (max): 190 A; Polarity: N; PackageReference: PG-TSDSON-8-1; PackageDescription: 8-Pin Plastic (Green) Thin Dual Small Outline Non-Leaded Package, 3.3 x 3.3 mm Body, 0.65 mm Pitch; Mounting Technology: Surface Mount
Q6 Q8 = CMP-1149-00026-1: N-Channel OptiMOS Small-Signal-Transistor, 60 V VDS, 0.3 A ID, -55 to 150 degC, PG-SOT23, Reel, Green; Manufacturer: Infineon; RDS (on) (max) (@4.5V): 4,000 mOhm; VDS (max): 60 V; IDpuls (max): 1.2Â A; QG: 0.4Â nC; RDS (on) (max): 3,000 mOhm; RthJA (max): 250 K/W; ID (max): 0.3Â A; VGS(th) (max): 2.5Â V; VGS(th) (min): 1.5Â V; Green: TRUE; Ptot (max): 0.5Â W; PackageDescription: 3-Pin Small Outline Transistor Package, 2.9 x 1.3 mm Body, 0.95 mm Pitch; Halogen-free: TRUE; ComponentLink2Description: Datasheet; ComponentLink1URL: http://www.infineon.com/; Packing: Reel; DatasheetVersion: Rev. 2.4; PartNumber: 2N7002; PackageReference: PG-SOT23; PackageVersion: Apr-08; ComponentLink3URL: http://www.infineon.com/dgdl/SOT23-Package_Overview.pdf?folderId=db3a30431936bc4b0119532290053c66&fileId=db3a30431936bc4b0119533468123c85; ComponentLink1Description: Manufacturer URL; Mounting Technology: Surface Mount; ComponentLink3Description: Package Specification; ComponentLink2URL: http://www.infineon.com/dgdl/2N7002_Rev2.4.pdf?folderId=db3a3043156fd573011622e10b5c1f67&fileId=db3a304319bc939a0119c2a9461e79e6
Q7 = CMP-1058-00762-2: MOSFET P-CH 50V 130MA SOT-23; Max Power Dissipation: 225mW; On-State Resistance: 10R; Nominal Vgs: 2V; Gate to Source Voltage (Vgs): 20V; Rise Time: 1ns; Turn-Off Delay Time: 16ns; Voltage Rating (DC): -50V; Turn-On Delay Time: 3.6ns; Number of Elements: 1; Current Rating: -130mA; Input Capacitance: 30pF; Threshold Voltage: -2V; Element Configuration: Single; Drain to Source Breakdown Voltage: 50V; Continuous Drain Current (ID): 130mA; Length: 0.119inch; Drain to Source Voltage (Vdss): 50V; Min Operating Temperature: -55°C; Contact Plating: Tin; Lead Free: Lead Free; Width: 0.055inch; Case/Package: SOT-23-3; Max Operating Temperature: 150°C; Halogen Free: Halogen Free; Radiation Hardening: No; Drain to Source Resistance: 10R; REACH SVHC: No SVHC; Power Dissipation: 225mW; Number of Pins: 3; Package Quantity: 1; Packaging: Tape and Reel; Fall Time: 1ns; Rds On Max: 10R; Height: 0.04inch
R28 = KRL1632E-M-R120-F-T5: RES 10 OHM 1% 3/4W 1206; Manufacturer: Susumu; Power (Watts): 0.75W, 3/4W; Temperature Coefficient: ±50ppm/°C; Part Number: KRL1632E-M-R120-F-T5; ComponentLink1Description: Datasheet; ComponentLink1URL: http://www.susumu.co.jp/common/pdf/n_catalog_partition09_en.pdf; ComponentLink2Description: DigiKey Link; ComponentLink2URL: https://www.digikey.com/en/products/detail/susumu/KRL1632E-M-R120-F-T5/3738009; Composition: Metal Foil; Device Package: 1206 (3216 Metric); Features: Automotive AEC-Q200, Current Sense; Height - Seated (Max): 0.028" (0.70mm); LastUpdated: 09.02.2024 20:54:46; Lifecycle Status: Active; Minimum Order: 1; Number of Terminations: 2; Operating Temperature: -55°C ~ 155°C; Package / Case: 1206 (3216 Metric); Packaging: TapeAndReel; PartId: 26840; Part Status: Active; Price: 0.09; Ratings: AEC-Q200; Resistance: 10; Series: KRL; Size / Dimension: 0.126" L x 0.063" W (3.20mm x 1.60mm); Supplier Device Package: 1206; Tolerance: ±1%; Value: 10
R29 = RNCS0603BKE10K0: RES 18K OHM 1% 0,1W 0603; Manufacturer: Stackpole Electronics Inc; Power (Watts): 0.063W, 1/16W; Temperature Coefficient: ±25ppm/°C; Tolerance: ±0.1%; Part Number: RNCS0603BKE10K0; Value: 18k; Composition: Thin Film; Device Package: 0603 (1608 Metric); Features: Anti-Corrosive, Automotive AEC-Q200, Moisture Resistant; Height - Seated (Max): 0.022" (0.55mm); LastUpdated: 09.02.2024 20:43:37; Lifecycle Status: Active; Minimum Order: 1; Number of Terminations: 2; Operating Temperature: -55°C ~ 155°C; Package / Case: 0603 (1608 Metric); Packaging: TapeAndReel; PartId: 4838; Part Status: Active; Price: 0.06; Ratings: AEC-Q200; Resistance: 18k; Series: RNCS; Size / Dimension: 0.061" L x 0.031" W (1.55mm x 0.80mm); Supplier Device Package: 0603
R30 R39 R45 R53 = RNCS0603BKE10K0: RES 470 OHM 1% 0,1W 0603; Manufacturer: Stackpole Electronics Inc; Power (Watts): 0.063W, 1/16W; Temperature Coefficient: ±25ppm/°C; Tolerance: ±0.1%; Part Number: RNCS0603BKE10K0; Value: 470; Composition: Thin Film; Device Package: 0603 (1608 Metric); Features: Anti-Corrosive, Automotive AEC-Q200, Moisture Resistant; Height - Seated (Max): 0.022" (0.55mm); LastUpdated: 09.02.2024 20:43:37; Lifecycle Status: Active; Minimum Order: 1; Number of Terminations: 2; Operating Temperature: -55°C ~ 155°C; Package / Case: 0603 (1608 Metric); Packaging: TapeAndReel; PartId: 4838; Part Status: Active; Price: 0.06; Ratings: AEC-Q200; Resistance: 470; Series: RNCS; Size / Dimension: 0.061" L x 0.031" W (1.55mm x 0.80mm); Supplier Device Package: 0603
R31 = RNCS0603BKE10K0: RES 2,2K OHM 1% 0,1W 0603; Manufacturer: Stackpole Electronics Inc; Power (Watts): 0.063W, 1/16W; Temperature Coefficient: ±25ppm/°C; Tolerance: ±0.1%; Part Number: RNCS0603BKE10K0; Value: 2,2k; Composition: Thin Film; Device Package: 0603 (1608 Metric); Features: Anti-Corrosive, Automotive AEC-Q200, Moisture Resistant; Height - Seated (Max): 0.022" (0.55mm); LastUpdated: 09.02.2024 20:43:37; Lifecycle Status: Active; Minimum Order: 1; Number of Terminations: 2; Operating Temperature: -55°C ~ 155°C; Package / Case: 0603 (1608 Metric); Packaging: TapeAndReel; PartId: 4838; Part Status: Active; Price: 0.06; Ratings: AEC-Q200; Resistance: 2,2k; Series: RNCS; Size / Dimension: 0.061" L x 0.031" W (1.55mm x 0.80mm); Supplier Device Package: 0603
R32 R33 = RNCS0603BKE10K0: RES 47K OHM 1% 0,1W 0603; Manufacturer: Stackpole Electronics Inc; Power (Watts): 0.063W, 1/16W; Temperature Coefficient: ±25ppm/°C; Tolerance: ±0.1%; Part Number: RNCS0603BKE10K0; Value: 47k; Composition: Thin Film; Device Package: 0603 (1608 Metric); Features: Anti-Corrosive, Automotive AEC-Q200, Moisture Resistant; Height - Seated (Max): 0.022" (0.55mm); LastUpdated: 09.02.2024 20:43:37; Lifecycle Status: Active; Minimum Order: 1; Number of Terminations: 2; Operating Temperature: -55°C ~ 155°C; Package / Case: 0603 (1608 Metric); Packaging: TapeAndReel; PartId: 4838; Part Status: Active; Price: 0.06; Ratings: AEC-Q200; Resistance: 47k; Series: RNCS; Size / Dimension: 0.061" L x 0.031" W (1.55mm x 0.80mm); Supplier Device Package: 0603
R34 = RT1206BRD0775KL: Manufacturer: Yageo; Power (Watts): 0.25W, 1/4W; Temperature Coefficient: ±25ppm/°C; Tolerance: ±0.1%; Part Number: RT1206BRD0775KL; Composition: Thin Film; Device Package: 1206 (3216 Metric); Height - Seated (Max): 0.026" (0.65mm); LastUpdated: 09.02.2024 20:54:46; Lifecycle Status: Active; Minimum Order: 1; Number of Terminations: 2; Operating Temperature: -55°C ~ 155°C; Package / Case: 1206 (3216 Metric); Packaging: TapeAndReel; PartId: 26866; Part Status: Active; Price: 0.09; Series: RT; Size / Dimension: 0.122" L x 0.063" W (3.10mm x 1.60mm); Supplier Device Package: 1206
R35 = CSM2512FT20L0: RES 0,005 OHM 1% 3W 2512; manufacturer: Stackpole Electronics Inc; Temperature Coefficient: ±50ppm/°C; value: 20 mOhms; Part Number: CSM2512FT20L0; componentlink1description: Datasheet; componentlink1url: https://www.seielect.com/Catalog/SEI-CSM.PDF; componentlink2description: DigiKey Link; componentlink2url: https://www.digikey.com/en/products/detail/stackpole-electronics-inc/CSM2512FT20L0/6270239; Composition: Metal Element; Device Package: 2512 (6332 Metric); Features: Current Sense; Height - Seated (Max): 0.035" (0.90mm); lastupdated: 03.06.2024 20:27:03; Lifecycle Status: Active; Minimum Order: 4000; Number of Terminations: 2; Operating Temperature: -55°C ~ 170°C; Package / Case: 2512 (6332 Metric); packaging: TapeAndReel; Part Status: Active; Power (Watts): 3W; price: 0.19; Resistance: 5m; series: CSM; Size / Dimension: 0.252" L x 0.126" W (6.40mm x 3.20mm); Supplier Device Package: 2512; Tolerance: ±1%
R36 = RNCS0603BKE10K0: RES 5,6K OHM 1% 0,1W 0603; Manufacturer: Stackpole Electronics Inc; Power (Watts): 0.063W, 1/16W; Temperature Coefficient: ±25ppm/°C; Tolerance: ±0.1%; Part Number: RNCS0603BKE10K0; Value: 5,6k; Composition: Thin Film; Device Package: 0603 (1608 Metric); Features: Anti-Corrosive, Automotive AEC-Q200, Moisture Resistant; Height - Seated (Max): 0.022" (0.55mm); LastUpdated: 09.02.2024 20:43:37; Lifecycle Status: Active; Minimum Order: 1; Number of Terminations: 2; Operating Temperature: -55°C ~ 155°C; Package / Case: 0603 (1608 Metric); Packaging: TapeAndReel; PartId: 4838; Part Status: Active; Price: 0.06; Ratings: AEC-Q200; Resistance: 5,6k; Series: RNCS; Size / Dimension: 0.061" L x 0.031" W (1.55mm x 0.80mm); Supplier Device Package: 0603
R37 = RNCS0603BKE10K0: RES 82 OHM 1% 0,1W 0603; Manufacturer: Stackpole Electronics Inc; Power (Watts): 0.063W, 1/16W; Temperature Coefficient: ±25ppm/°C; Tolerance: ±0.1%; Part Number: RNCS0603BKE10K0; Value: 82; Composition: Thin Film; Device Package: 0603 (1608 Metric); Features: Anti-Corrosive, Automotive AEC-Q200, Moisture Resistant; Height - Seated (Max): 0.022" (0.55mm); LastUpdated: 09.02.2024 20:43:37; Lifecycle Status: Active; Minimum Order: 1; Number of Terminations: 2; Operating Temperature: -55°C ~ 155°C; Package / Case: 0603 (1608 Metric); Packaging: TapeAndReel; PartId: 4838; Part Status: Active; Price: 0.06; Ratings: AEC-Q200; Resistance: 82; Series: RNCS; Size / Dimension: 0.061" L x 0.031" W (1.55mm x 0.80mm); Supplier Device Package: 0603
R38 R51 = RNCS0603BKE10K0: RES 10K OHM 1% 0,1W 0603; Manufacturer: Stackpole Electronics Inc; Power (Watts): 0.063W, 1/16W; Temperature Coefficient: ±25ppm/°C; Tolerance: ±0.1%; Part Number: RNCS0603BKE10K0; Value: 10k; Composition: Thin Film; Device Package: 0603 (1608 Metric); Features: Anti-Corrosive, Automotive AEC-Q200, Moisture Resistant; Height - Seated (Max): 0.022" (0.55mm); LastUpdated: 09.02.2024 20:43:37; Lifecycle Status: Active; Minimum Order: 1; Number of Terminations: 2; Operating Temperature: -55°C ~ 155°C; Package / Case: 0603 (1608 Metric); Packaging: TapeAndReel; PartId: 4838; Part Status: Active; Price: 0.06; Ratings: AEC-Q200; Resistance: 10k; Series: RNCS; Size / Dimension: 0.061" L x 0.031" W (1.55mm x 0.80mm); Supplier Device Package: 0603
R40 = RNCS0603BKE10K0: RES 8,2K OHM 1% 0,1W 0603; Manufacturer: Stackpole Electronics Inc; Power (Watts): 0.063W, 1/16W; Temperature Coefficient: ±25ppm/°C; Tolerance: ±0.1%; Part Number: RNCS0603BKE10K0; Value: 8,2k; Composition: Thin Film; Device Package: 0603 (1608 Metric); Features: Anti-Corrosive, Automotive AEC-Q200, Moisture Resistant; Height - Seated (Max): 0.022" (0.55mm); LastUpdated: 09.02.2024 20:43:37; Lifecycle Status: Active; Minimum Order: 1; Number of Terminations: 2; Operating Temperature: -55°C ~ 155°C; Package / Case: 0603 (1608 Metric); Packaging: TapeAndReel; PartId: 4838; Part Status: Active; Price: 0.06; Ratings: AEC-Q200; Resistance: 8,2k; Series: RNCS; Size / Dimension: 0.061" L x 0.031" W (1.55mm x 0.80mm); Supplier Device Package: 0603
R41 = RNCS0603BKE10K0: RES {=RF2_value} OHM 1% 0,1W 0603; Manufacturer: Stackpole Electronics Inc; Power (Watts): 0.063W, 1/16W; Temperature Coefficient: ±25ppm/°C; Tolerance: ±0.1%; Part Number: RNCS0603BKE10K0; Value: =RF2_value; Composition: Thin Film; Device Package: 0603 (1608 Metric); Features: Anti-Corrosive, Automotive AEC-Q200, Moisture Resistant; Height - Seated (Max): 0.022" (0.55mm); LastUpdated: 09.02.2024 20:43:37; Lifecycle Status: Active; Minimum Order: 1; Number of Terminations: 2; Operating Temperature: -55°C ~ 155°C; Package / Case: 0603 (1608 Metric); Packaging: TapeAndReel; PartId: 4838; Part Status: Active; Price: 0.06; Ratings: AEC-Q200; Resistance: =RF2_value; Series: RNCS; Size / Dimension: 0.061" L x 0.031" W (1.55mm x 0.80mm); Supplier Device Package: 0603
R42 = RNCS0603BKE10K0: RES {=RF1_value} OHM 1% 0,1W 0603; Manufacturer: Stackpole Electronics Inc; Power (Watts): 0.063W, 1/16W; Temperature Coefficient: ±25ppm/°C; Tolerance: ±0.1%; Part Number: RNCS0603BKE10K0; Value: =RF1_value; Composition: Thin Film; Device Package: 0603 (1608 Metric); Features: Anti-Corrosive, Automotive AEC-Q200, Moisture Resistant; Height - Seated (Max): 0.022" (0.55mm); LastUpdated: 09.02.2024 20:43:37; Lifecycle Status: Active; Minimum Order: 1; Number of Terminations: 2; Operating Temperature: -55°C ~ 155°C; Package / Case: 0603 (1608 Metric); Packaging: TapeAndReel; PartId: 4838; Part Status: Active; Price: 0.06; Ratings: AEC-Q200; Resistance: =RF1_value; Series: RNCS; Size / Dimension: 0.061" L x 0.031" W (1.55mm x 0.80mm); Supplier Device Package: 0603
R43 R46 R52 = RNCS0603BKE10K0: RES 4,7K OHM 1% 0,1W 0603; Manufacturer: Stackpole Electronics Inc; Power (Watts): 0.063W, 1/16W; Temperature Coefficient: ±25ppm/°C; Tolerance: ±0.1%; Part Number: RNCS0603BKE10K0; Value: 4,7k; Composition: Thin Film; Device Package: 0603 (1608 Metric); Features: Anti-Corrosive, Automotive AEC-Q200, Moisture Resistant; Height - Seated (Max): 0.022" (0.55mm); LastUpdated: 09.02.2024 20:43:37; Lifecycle Status: Active; Minimum Order: 1; Number of Terminations: 2; Operating Temperature: -55°C ~ 155°C; Package / Case: 0603 (1608 Metric); Packaging: TapeAndReel; PartId: 4838; Part Status: Active; Price: 0.06; Ratings: AEC-Q200; Resistance: 4,7k; Series: RNCS; Size / Dimension: 0.061" L x 0.031" W (1.55mm x 0.80mm); Supplier Device Package: 0603
R44 = RNCS0603BKE10K0: RES 7,5K OHM 1% 0,1W 0603; Manufacturer: Stackpole Electronics Inc; Power (Watts): 0.063W, 1/16W; Temperature Coefficient: ±25ppm/°C; Tolerance: ±0.1%; Part Number: RNCS0603BKE10K0; Value: 7,5k; Composition: Thin Film; Device Package: 0603 (1608 Metric); Features: Anti-Corrosive, Automotive AEC-Q200, Moisture Resistant; Height - Seated (Max): 0.022" (0.55mm); LastUpdated: 09.02.2024 20:43:37; Lifecycle Status: Active; Minimum Order: 1; Number of Terminations: 2; Operating Temperature: -55°C ~ 155°C; Package / Case: 0603 (1608 Metric); Packaging: TapeAndReel; PartId: 4838; Part Status: Active; Price: 0.06; Ratings: AEC-Q200; Resistance: 7,5k; Series: RNCS; Size / Dimension: 0.061" L x 0.031" W (1.55mm x 0.80mm); Supplier Device Package: 0603
R47 = RNCS0603BKE10K0: RES {=RF3_value} OHM 1% 0,1W 0603; Manufacturer: Stackpole Electronics Inc; Power (Watts): 0.063W, 1/16W; Temperature Coefficient: ±25ppm/°C; Tolerance: ±0.1%; Part Number: RNCS0603BKE10K0; Value: =RF3_value; Composition: Thin Film; Device Package: 0603 (1608 Metric); Features: Anti-Corrosive, Automotive AEC-Q200, Moisture Resistant; Height - Seated (Max): 0.022" (0.55mm); LastUpdated: 09.02.2024 20:43:37; Lifecycle Status: Active; Minimum Order: 1; Number of Terminations: 2; Operating Temperature: -55°C ~ 155°C; Package / Case: 0603 (1608 Metric); Packaging: TapeAndReel; PartId: 4838; Part Status: Active; Price: 0.06; Ratings: AEC-Q200; Resistance: =RF3_value; Series: RNCS; Size / Dimension: 0.061" L x 0.031" W (1.55mm x 0.80mm); Supplier Device Package: 0603
R48 = RNCS0603BKE10K0: RES 3,3K OHM 1% 0,1W 0603; Manufacturer: Stackpole Electronics Inc; Power (Watts): 0.063W, 1/16W; Temperature Coefficient: ±25ppm/°C; Tolerance: ±0.1%; Part Number: RNCS0603BKE10K0; Value: 3,3k; Composition: Thin Film; Device Package: 0603 (1608 Metric); Features: Anti-Corrosive, Automotive AEC-Q200, Moisture Resistant; Height - Seated (Max): 0.022" (0.55mm); LastUpdated: 09.02.2024 20:43:37; Lifecycle Status: Active; Minimum Order: 1; Number of Terminations: 2; Operating Temperature: -55°C ~ 155°C; Package / Case: 0603 (1608 Metric); Packaging: TapeAndReel; PartId: 4838; Part Status: Active; Price: 0.06; Ratings: AEC-Q200; Resistance: 3,3k; Series: RNCS; Size / Dimension: 0.061" L x 0.031" W (1.55mm x 0.80mm); Supplier Device Package: 0603
R49 R50 = RNCS0603BKE10K0: RES 0 OHM 1% 0,1W 0603; Manufacturer: Stackpole Electronics Inc; Power (Watts): 0.063W, 1/16W; Temperature Coefficient: ±25ppm/°C; Tolerance: ±0.1%; Part Number: RNCS0603BKE10K0; Value: jumper; Composition: Thin Film; Device Package: 0603 (1608 Metric); Features: Anti-Corrosive, Automotive AEC-Q200, Moisture Resistant; Height - Seated (Max): 0.022" (0.55mm); LastUpdated: 09.02.2024 20:43:37; Lifecycle Status: Active; Minimum Order: 1; Number of Terminations: 2; Operating Temperature: -55°C ~ 155°C; Package / Case: 0603 (1608 Metric); Packaging: TapeAndReel; PartId: 4838; Part Status: Active; Price: 0.06; Ratings: AEC-Q200; Resistance: jumper; Series: RNCS; Size / Dimension: 0.061" L x 0.031" W (1.55mm x 0.80mm); Supplier Device Package: 0603
TP3 TP4 = Keystone 5006 Test Point: Keystone 5006 Test Point (BLACK)
U5 = LM25116MHX/NOPB: Wide Range Synchronous Buck Controller, 20-pin TSSOP-EP, Pb-Free; Manufacturer: Texas Instruments; CompType: Switcher; PowerWise: Y; PackageTopMarking: NSUZXYTT*LM25116*MH; PackageDescription: Molded TSSOP, Jedec, 6.5 x 4.4 x 0.9mm Body, 20 Lead, 0.65mm Pitch, Exposed Pad; PinCount: 20; Code_JEDEC: MO-153-ACT; ComponentLink1URL: http://www.ti.com/general/docs/lit/getliterature.tsp?genericPartNumber=LM25116&fileType=pdf; RoHS: Y; ComponentLink1Description: Datasheet URL; PackageReference: PWP0020A
U6 = CMP-0188-00800-2: 7-Bit Single I2C Digital POT with Non-Volatile Memory, 8-pin MSOP, Extended Temperature; ComponentLink3URL: http://www.microchip.com/stellent/groups/techpub_sg/documents/packagingspec/en012702.pdf; ComponentLink1URL: http://www.microchip.com/; ComponentLink3Description: Package Specification; PackageReference: MSOP-MS8; PackageVersion: revBB, Aug-2009; PackageDescription: 8-Lead Plastic Micro Small Outline Package (MS) [MSOP]; ComponentLink2Description: Datasheet; ComponentLink1Description: Manufacturer URL; RevisionNote: URLs added.; ComponentLink2URL: http://ww1.microchip.com/downloads/en/DeviceDoc/22107a.pdf; DatasheetVersion: revA, Nov-2008